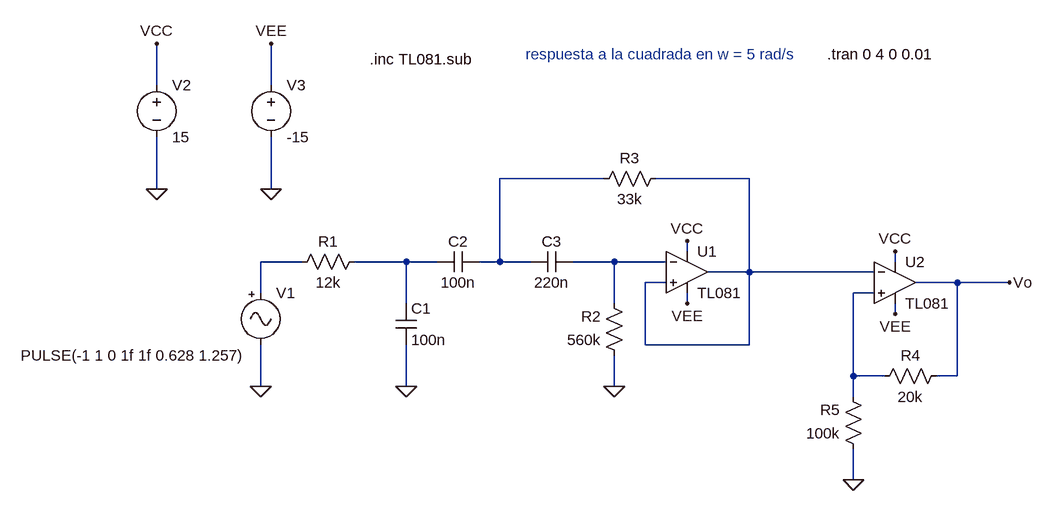
[diagram p0: schematic rtaCuad1.asc]
rtaCuad1.asc, the LTspice schematic file:
Version 4
SHEET 1 1176 688
WIRE -400 64 -400 0
WIRE -224 64 -224 0
WIRE 288 208 128 208
WIRE 512 208 368 208
WIRE -400 224 -400 144
WIRE -224 224 -224 144
WIRE 416 320 416 304
WIRE -176 336 -240 336
WIRE -16 336 -96 336
WIRE 32 336 -16 336
WIRE 128 336 128 208
WIRE 128 336 96 336
WIRE 176 336 128 336
WIRE 304 336 240 336
WIRE 384 336 304 336
WIRE 736 336 736 320
WIRE 512 352 512 208
WIRE 512 352 448 352
WIRE 704 352 512 352
WIRE 384 368 352 368
WIRE 832 368 768 368
WIRE 912 368 832 368
WIRE -240 384 -240 336
WIRE 704 384 672 384
WIRE -16 400 -16 336
WIRE 304 400 304 336
WIRE 416 400 416 384
WIRE 736 416 736 400
WIRE 352 464 352 368
WIRE 512 464 512 352
WIRE 512 464 352 464
WIRE 672 512 672 384
WIRE 720 512 672 512
WIRE 832 512 832 368
WIRE 832 512 800 512
WIRE -240 528 -240 464
WIRE -16 528 -16 464
WIRE 304 528 304 480
WIRE 672 544 672 512
WIRE 672 672 672 624
FLAG -240 528 0
FLAG -400 224 0
FLAG -400 0 VCC
FLAG -224 224 0
FLAG -224 0 VEE
FLAG -16 528 0
FLAG 304 528 0
FLAG 416 304 VCC
FLAG 416 400 VEE
FLAG 736 320 VCC
FLAG 736 416 VEE
FLAG 672 672 0
FLAG 912 368 Vo
SYMBOL Voltage -400 48 R0
SYMATTR InstName V2
SYMATTR Value 15
SYMBOL Voltage -224 48 R0
SYMATTR InstName V3
SYMATTR Value -15
SYMBOL Misc/signal -240 368 R0
WINDOW 3 -369 112 Left 2
SYMATTR Value PULSE(-1 1 0 1f 1f 0.628 1.257)
SYMATTR InstName V1
SYMBOL Cap -32 400 R0
SYMATTR InstName C1
SYMATTR Value 100n
SYMATTR SpiceLine IC=0
SYMBOL Cap 96 320 R90
WINDOW 0 0 32 VBottom 2
WINDOW 3 32 32 VTop 2
SYMATTR InstName C2
SYMATTR Value 100n
SYMATTR SpiceLine IC=0
SYMBOL Cap 240 320 R90
WINDOW 0 0 32 VBottom 2
WINDOW 3 32 32 VTop 2
SYMATTR InstName C3
SYMATTR Value 220n
SYMATTR SpiceLine IC=0
SYMBOL Res -80 320 R90
WINDOW 0 0 56 VBottom 2
WINDOW 3 32 56 VTop 2
SYMATTR InstName R1
SYMATTR Value 12k
SYMBOL Res 320 496 R180
WINDOW 0 36 76 Left 2
WINDOW 3 36 40 Left 2
SYMATTR InstName R2
SYMATTR Value 560k
SYMBOL Res 272 224 R270
WINDOW 0 32 56 VTop 2
WINDOW 3 0 56 VBottom 2
SYMATTR InstName R3
SYMATTR Value 33k
SYMBOL OpAmps/opamp2 416 288 R0
SYMATTR InstName U1
SYMATTR Value TL081
SYMBOL OpAmps/opamp2 736 304 R0
SYMATTR InstName U2
SYMATTR Value TL081
SYMBOL Res 816 496 R90
WINDOW 0 0 56 VBottom 2
WINDOW 3 32 56 VTop 2
SYMATTR InstName R4
SYMATTR Value 20k
SYMBOL Res 688 640 R180
WINDOW 0 36 76 Left 2
WINDOW 3 36 40 Left 2
SYMATTR InstName R5
SYMATTR Value 100k
TEXT -72 24 Left 2 !.inc TL081.sub
TEXT 632 16 Left 2 !.tran 0 4 0 0.01
TEXT 168 16 Left 2 ;respuesta a la cuadrada en w = 5 rad/s

The netlist it stands for:
* rtaCuad1.asc
V2 VCC 0 15
V3 VEE 0 -15
V1 N003 0 PULSE(-1 1 0 1f 1f 0.628 1.257)
C1 N004 0 100n IC=0
C2 N001 N004 100n IC=0
C3 N005 N001 220n IC=0
R1 N004 N003 12k
R2 0 N005 560k
R3 N001 N002 33k
XU1 N002 N005 VCC VEE N002 TL081  ; pins In+ In- V+ V- OUT
XU2 N006 N002 VCC VEE Vo TL081  ; pins In+ In- V+ V- OUT
R4 Vo N006 20k
R5 0 N006 100k
.inc TL081.sub
.tran 0 4 0 0.01
* respuesta a la cuadrada en w = 5 rad/s
.backanno
.end